# Altium schematic sheet Main.SchDoc
size A4
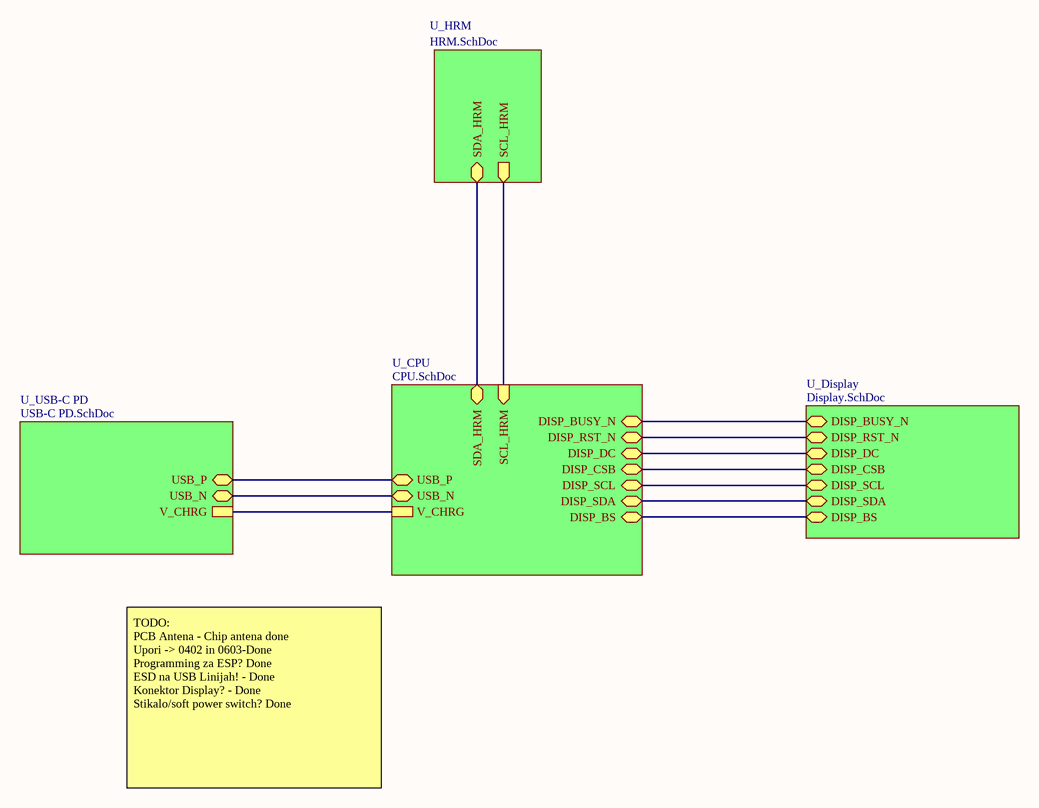
[diagram p0: Main.SchDoc]

## Sub-sheets
U_CPU = CPU.SchDoc: SDA_HRM (bidir), SCL_HRM (in), DISP_BUSY_N (bidir), DISP_RST_N (bidir), DISP_DC (bidir), DISP_CSB (bidir), DISP_SCL (bidir), DISP_SDA (bidir), DISP_BS (bidir), USB_P (bidir), USB_N (bidir), V_CHRG
U_Display = Display.SchDoc: DISP_BUSY_N (bidir), DISP_RST_N (bidir), DISP_DC (bidir), DISP_CSB (bidir), DISP_SCL (bidir), DISP_SDA (bidir), DISP_BS (bidir)
U_HRM = HRM.SchDoc: SDA_HRM (bidir), SCL_HRM (out)
U_USB-C PD = USB-C PD.SchDoc: USB_P (bidir), USB_N (bidir), V_CHRG

## Nets
(unnamed): sheet U_HRM/SDA_HRM, sheet U_CPU/SDA_HRM
(unnamed): sheet U_HRM/SCL_HRM, sheet U_CPU/SCL_HRM
(unnamed): sheet U_CPU/DISP_BUSY_N, sheet U_Display/DISP_BUSY_N
(unnamed): sheet U_CPU/DISP_RST_N, sheet U_Display/DISP_RST_N
(unnamed): sheet U_CPU/DISP_DC, sheet U_Display/DISP_DC
(unnamed): sheet U_CPU/DISP_CSB, sheet U_Display/DISP_CSB
(unnamed): sheet U_CPU/DISP_SCL, sheet U_Display/DISP_SCL
(unnamed): sheet U_CPU/DISP_SDA, sheet U_Display/DISP_SDA
(unnamed): sheet U_CPU/DISP_BS, sheet U_Display/DISP_BS
(unnamed): sheet U_CPU/USB_P, sheet U_USB-C PD/USB_P
(unnamed): sheet U_CPU/USB_N, sheet U_USB-C PD/USB_N
(unnamed): sheet U_CPU/V_CHRG, sheet U_USB-C PD/V_CHRG

## Notes on the sheet
- TODO:
  PCB Antena - Chip antena done
  Upori -> 0402 in 0603-Done
  Programming za ESP? Done
  ESD na USB Linijah! - Done
  Konektor Display? - Done
  Stikalo/soft power switch? Done